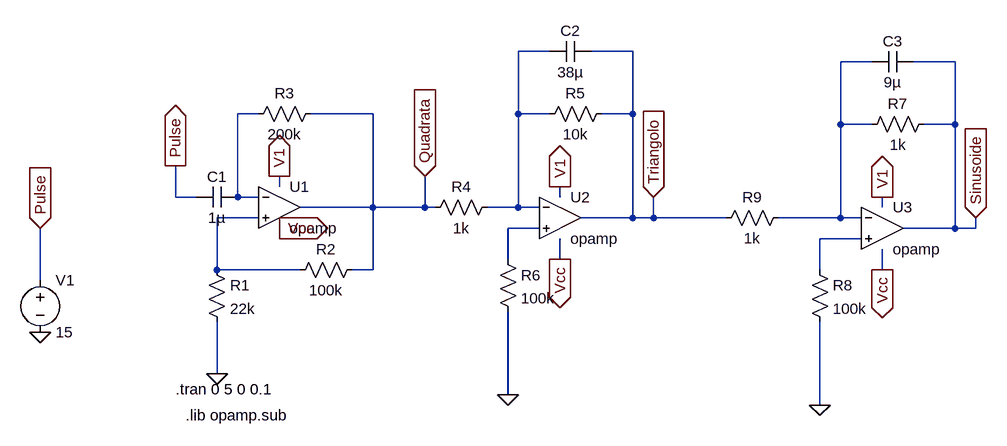
[diagram p0: schematic Progetto_PSE_ideale.asc]
Progetto_PSE_ideale.asc, the LTspice schematic file:
Version 4
SHEET 1 1248 680
WIRE 352 -144 304 -144
WIRE 480 -144 416 -144
WIRE 848 -128 800 -128
WIRE 976 -128 912 -128
WIRE -96 -48 -128 -48
WIRE 80 -48 -16 -48
WIRE 304 -48 304 -144
WIRE 352 -48 304 -48
WIRE 480 -48 480 -144
WIRE 480 -48 432 -48
WIRE 800 -32 800 -128
WIRE 848 -32 800 -32
WIRE 976 -32 976 -128
WIRE 976 -32 928 -32
WIRE -64 64 -64 48
WIRE -224 80 -224 32
WIRE -192 80 -224 80
WIRE -128 80 -128 -48
WIRE -96 80 -128 80
WIRE 368 80 368 64
WIRE 80 96 80 -48
WIRE 80 96 -32 96
WIRE 160 96 160 48
WIRE 160 96 80 96
WIRE 176 96 160 96
WIRE 304 96 304 -48
WIRE 304 96 256 96
WIRE 336 96 304 96
WIRE 864 96 864 80
WIRE -96 112 -160 112
WIRE 480 112 480 -48
WIRE 480 112 400 112
WIRE 512 112 512 80
WIRE 512 112 480 112
WIRE 624 112 512 112
WIRE 800 112 800 -32
WIRE 800 112 704 112
WIRE 832 112 800 112
WIRE 336 128 288 128
WIRE 976 128 976 -32
WIRE 976 128 896 128
WIRE 1008 128 1008 112
WIRE 1008 128 976 128
WIRE 832 144 768 144
WIRE 288 176 288 128
WIRE 368 176 368 144
WIRE -160 192 -160 112
WIRE -32 192 -160 192
WIRE 80 192 80 96
WIRE 80 192 48 192
WIRE 768 192 768 144
WIRE 864 192 864 160
WIRE -432 208 -432 128
WIRE -160 352 -160 272
WIRE 288 384 288 256
WIRE 768 400 768 272
FLAG -160 352 0
FLAG 288 384 0
FLAG 368 64 V1
IOPIN 368 64 Out
FLAG -64 48 V1
IOPIN -64 48 Out
FLAG -64 128 Vcc
IOPIN -64 128 Out
FLAG 368 176 Vcc
IOPIN 368 176 Out
FLAG 512 80 Triangolo
IOPIN 512 80 In
FLAG 160 48 Quadrata
IOPIN 160 48 In
FLAG 768 400 0
FLAG 864 80 V1
IOPIN 864 80 Out
FLAG 864 192 Vcc
IOPIN 864 192 Out
FLAG 1008 112 Sinusoide
IOPIN 1008 112 In
FLAG -432 288 0
FLAG -432 128 Pulse
IOPIN -432 128 In
FLAG -224 32 Pulse
IOPIN -224 32 Out
SYMBOL cap -128 64 R90
WINDOW 0 0 32 VBottom 2
WINDOW 3 32 32 VTop 2
SYMATTR InstName C1
SYMATTR Value 1µ
SYMBOL res -176 176 R0
SYMATTR InstName R1
SYMATTR Value 22k
SYMBOL res 64 176 R90
WINDOW 0 0 56 VBottom 2
WINDOW 3 32 56 VTop 2
SYMATTR InstName R2
SYMATTR Value 100k
SYMBOL res 0 -64 R90
WINDOW 0 0 56 VBottom 2
WINDOW 3 32 56 VTop 2
SYMATTR InstName R3
SYMATTR Value 200k
SYMBOL res 272 80 R90
WINDOW 0 0 56 VBottom 2
WINDOW 3 32 56 VTop 2
SYMATTR InstName R4
SYMATTR Value 1k
SYMBOL res 448 -64 R90
WINDOW 0 0 56 VBottom 2
WINDOW 3 32 56 VTop 2
SYMATTR InstName R5
SYMATTR Value 10k
SYMBOL cap 416 -160 R90
WINDOW 0 0 32 VBottom 2
WINDOW 3 32 32 VTop 2
SYMATTR InstName C2
SYMATTR Value 38µ
SYMBOL res 272 160 R0
SYMATTR InstName R6
SYMATTR Value 100k
SYMBOL res 944 -48 R90
WINDOW 0 0 56 VBottom 2
WINDOW 3 32 56 VTop 2
SYMATTR InstName R7
SYMATTR Value 1k
SYMBOL cap 912 -144 R90
WINDOW 0 0 32 VBottom 2
WINDOW 3 32 32 VTop 2
SYMATTR InstName C3
SYMATTR Value 9µ
SYMBOL res 752 176 R0
SYMATTR InstName R8
SYMATTR Value 100k
SYMBOL res 720 96 R90
WINDOW 0 0 56 VBottom 2
WINDOW 3 32 56 VTop 2
SYMATTR InstName R9
SYMATTR Value 1k
SYMBOL Opamps\\opamp -64 32 R0
SYMATTR InstName U1
SYMBOL Opamps\\opamp 368 48 R0
SYMATTR InstName U2
SYMBOL Opamps\\opamp 864 64 R0
SYMATTR InstName U3
SYMBOL voltage -432 192 R0
WINDOW 123 0 0 Left 0
WINDOW 39 0 0 Left 0
SYMATTR InstName V1
SYMATTR Value 15
TEXT -224 376 Left 2 !.tran 0 5 0 0.1
TEXT -208 416 Left 2 !.lib opamp.sub

The netlist it stands for:
* Progetto_PSE_ideale.asc
C1 N003 Pulse 1µ
R1 N004 0 22k
R2 Quadrata N004 100k
R3 Quadrata N003 200k
R4 N001 Quadrata 1k
R5 Triangolo N001 10k
C2 Triangolo N001 38µ
R6 N005 0 100k
R7 Sinusoide N002 1k
C3 Sinusoide N002 9µ
R8 N006 0 100k
R9 N002 Triangolo 1k
XU1 N003 N004 Quadrata opamp Aol=100K GBW=10Meg  ; pins invin noninvin out
XU2 N001 N005 Triangolo opamp Aol=100K GBW=10Meg  ; pins invin noninvin out
XU3 N002 N006 Sinusoide opamp Aol=100K GBW=10Meg  ; pins invin noninvin out
V1 Pulse 0 15
.tran 0 5 0 0.1
.lib opamp.sub
.backanno
.end